# Altium project Worldskills Pre-Comp Task.PrjPcb
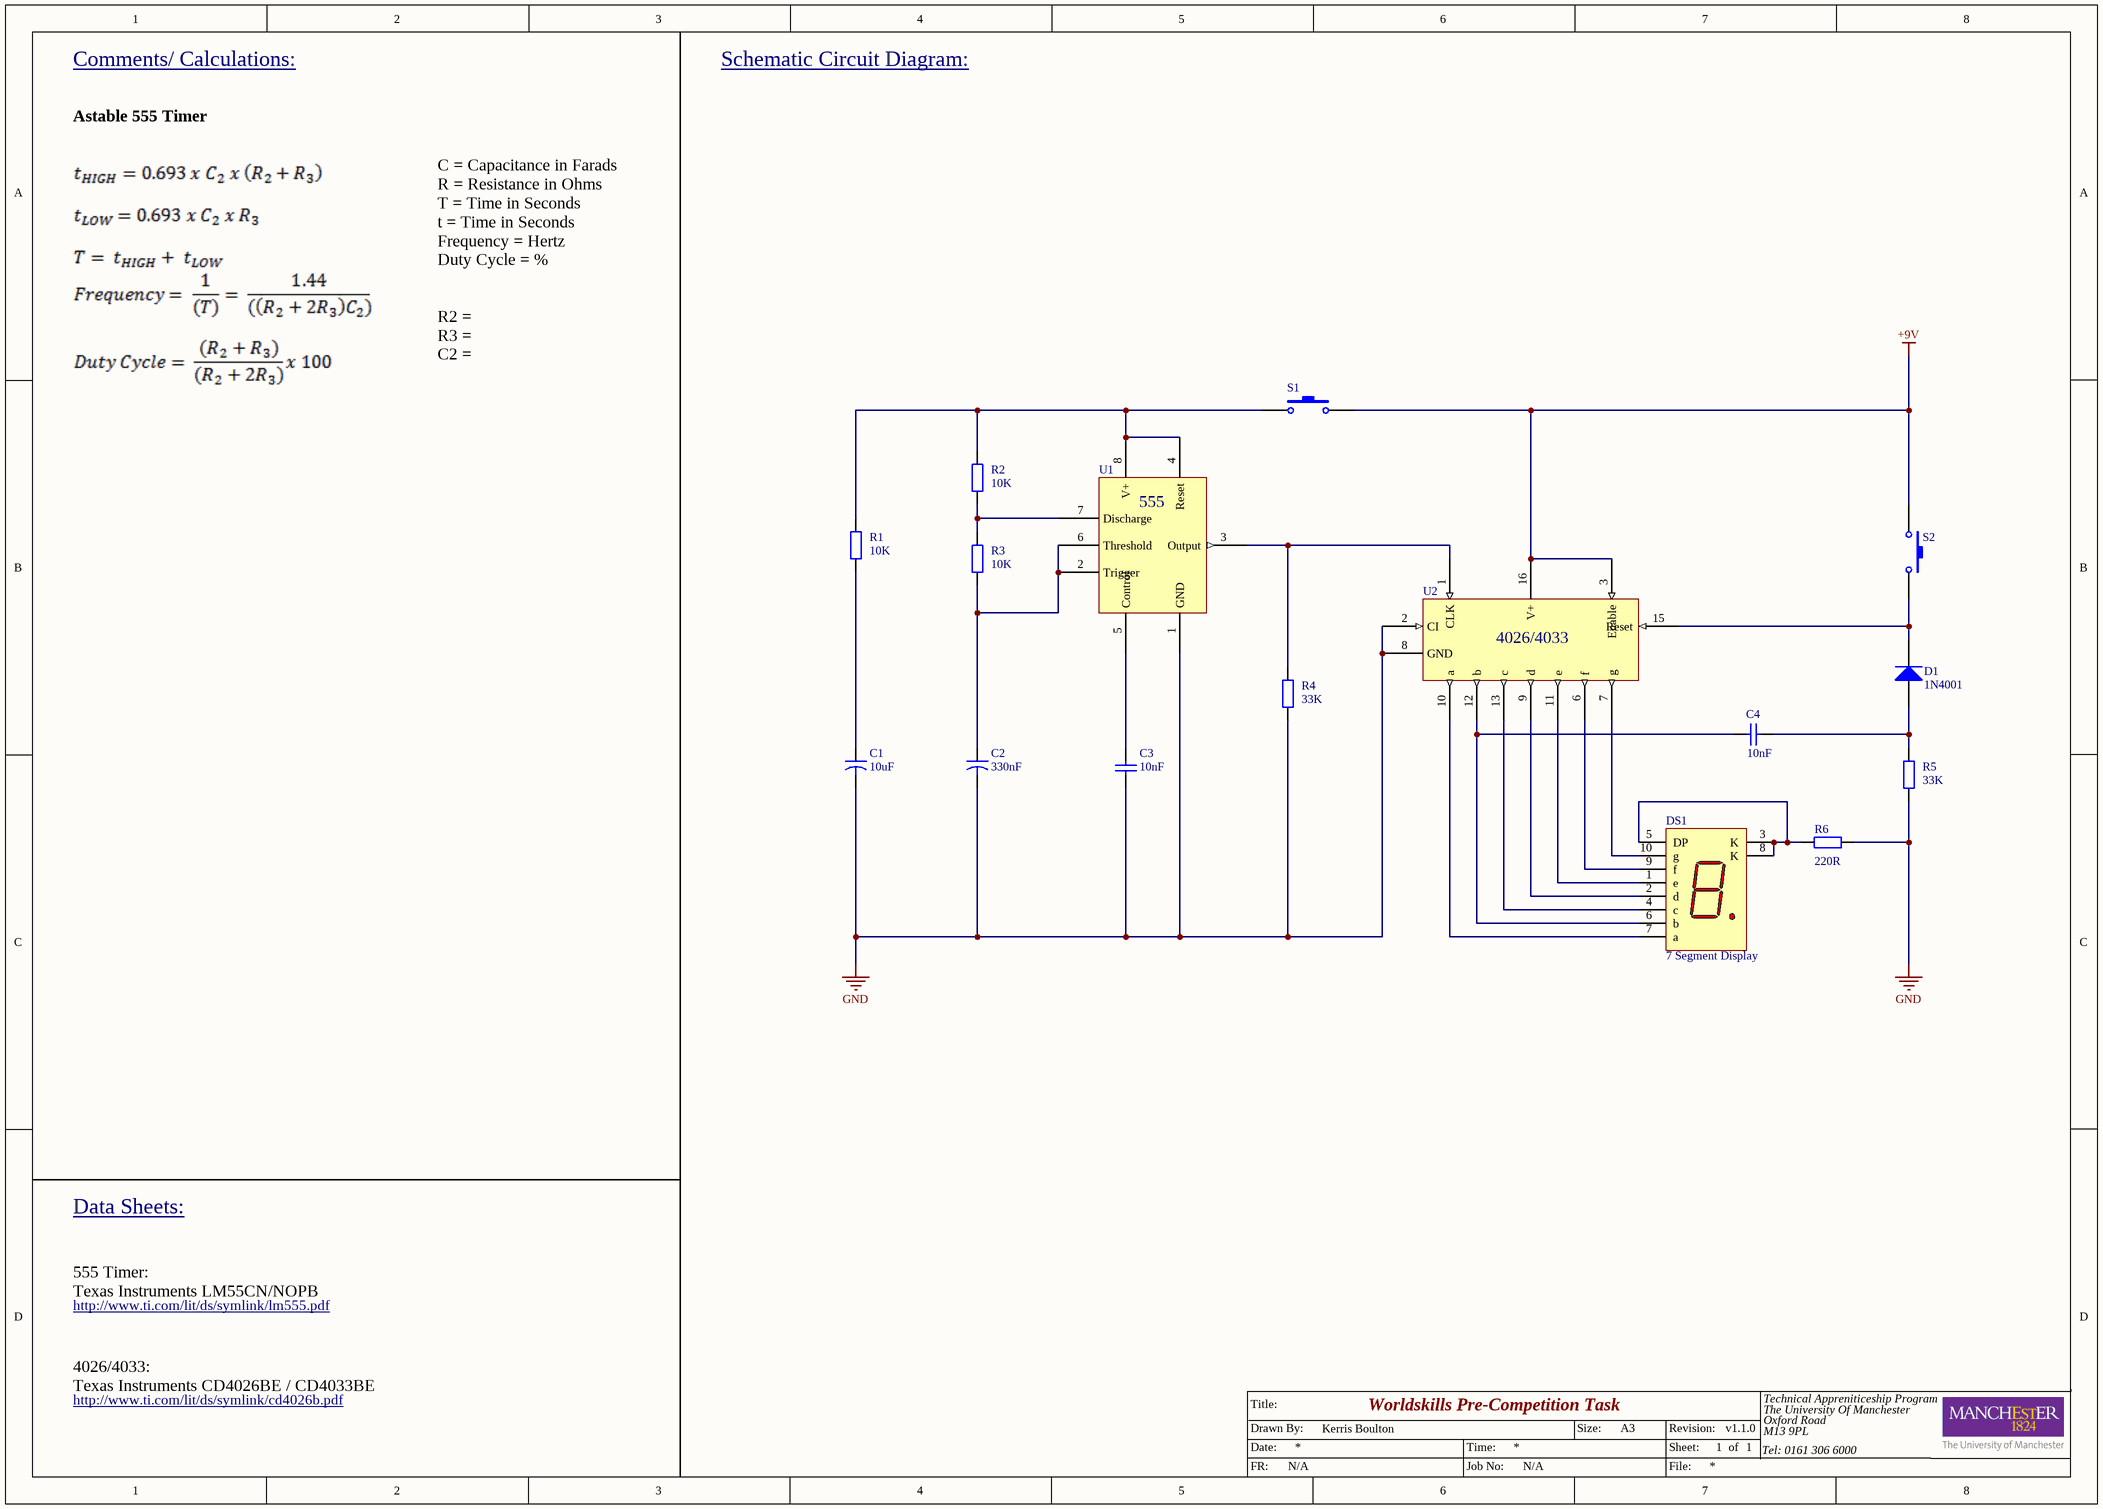
[diagram p0: Figure1.SchDoc]
1 sheet, 16 parts. Net scope: global (net labels, ports and power ports of the same name join across sheets).

## Sheet Figure1.SchDoc: Worldskills Pre-Competition Task
size A3; DrawnBy: Kerris Boulton; Organization: Technical Appreniticeship Program; Address1: The University Of Manchester; Address2: Oxford Road; Address3: M13 9PL; Address4: Tel: 0161 306 6000; DocumentNumber: 1; Revision: v1.1.0; SheetNumber: 1; SheetTotal: 1; FR: N/A; JobNo: N/A

### Parts
C1  10uF  [CAPR5-4X5]
C2  330nF  [CAPR5-4X5]
C3  10nF  [RAD-0.3]
C4  10nF  [RAD-0.3]
D1  1N4001  [DO-41]
DS1  7 Segment Display  [A]
R1  10K  [AXIAL-0.4]
R2  10K  [AXIAL-0.4]
R3  10K  [AXIAL-0.4]
R4  33K  [AXIAL-0.4]
R5  33K  [AXIAL-0.4]
R6  220R  [AXIAL-0.4]
S1  SW-PB  [SPST-2]  (value not drawn)
S2  SW-PB  [SPST-2]  (value not drawn)
U1  555  [555]  (value not drawn)
U2  4026/4033  [4026/4033]  (value not drawn)

### Nets
+9V: S1.2 S2.1 U2.3(Enable) U2.16(V+)
GND: C1.2 C2.2 C3.1 R4.1 R5.1 R6.2 U1.1(GND) U2.2(CI) U2.8(GND)
NetC1_1: C1.1 R1.1
NetC2_1: C2.1 R3.1 U1.2(Trigger) U1.6(Threshold)
NetC3_2: C3.2 U1.5(Control)
NetC4_1: C4.1 DS1.6(b) U2.12(b)
NetC4_2: C4.2 D1.1(A) R5.2
NetD1_2: D1.2(K) S2.2 U2.15(Reset)
NetDS1_1: DS1.1(e) U2.11(e)
NetDS1_2: DS1.2(d) U2.9(d)
NetDS1_3: DS1.3(K) DS1.5(DP) DS1.8(K) R6.1
NetDS1_4: DS1.4(c) U2.13(c)
NetDS1_7: DS1.7(a) U2.10(a)
NetDS1_9: DS1.9(f) U2.6(f)
NetDS1_10: DS1.10(g) U2.7(g)
NetR1_2: R1.2 R2.2 S1.1 U1.4(Reset) U1.8(V+)
NetR2_1: R2.1 R3.2 U1.7(Discharge)
NetR4_2: R4.2 U1.3(Output) U2.1(CLK)

### Notes on the sheet
- Comments/ Calculations:
- Schematic Circuit Diagram:
- Astable 555 Timer
- C = Capacitance in Farads
  R = Resistance in Ohms
  T = Time in Seconds
  t = Time in Seconds
  Frequency = Hertz
  Duty Cycle = %
  R2 =
  R3 =
  C2 =
- Data Sheets:
- http://www.ti.com/lit/ds/symlink/lm555.pdf
- 555 Timer:
  Texas Instruments LM55CN/NOPB
  4026/4033:
  Texas Instruments CD4026BE / CD4033BE
- http://www.ti.com/lit/ds/symlink/cd4026b.pdf <http://>
- Title:
- Date:
- Drawn By:
- Time:
- Size:
- A3
- Revision:
- Sheet:
- of
- FR:
- Job No:
- File:

### Library data of the parts
C1 C2 = Cap2: Capacitor; Published: 23-Sep-2002; PackageReference: CAPR5-4X5; Publisher: Altium Limited; PackageDescription: Capacitor; 2 Leads
  C1: Value: 10uF
  C2: Value: 330nF
C3 C4 = Cap: Capacitor; Published: 8-Jun-2000; LatestRevisionDate: 17-Jul-2002; LatestRevisionNote: Re-released for DXP Platform.; PackageReference: RAD-0.3; Publisher: Altium Limited; PackageDescription: Radial Cap, Thru-Hole; 2 Leads; 0.3 in Pin Spacing; Value: 10nF
D1 = Diode 1N4001: 1 Amp General Purpose Rectifier; Published: 8-Jun-2000; LatestRevisionDate: 17-Jul-2002; LatestRevisionNote: Re-released for DXP Platform.; DatasheetVersion: 1998; PackageVersion: Aug-1999; PackageReference: DO-41; Publisher: Altium Limited; PackageDescription: Diode, Axial; Body 5.2 x 2.7 mm (LxDia. max), Lead Dia. 0.86 mm (max); Code_JEDEC: DO-204-AL; ComponentLink1Description: Manufacturer Link; ComponentLink1URL: http://www.fairchildsemi.com/; ComponentLink2Description: Datasheet; ComponentLink2URL: http://www.fairchildsemi.com/ds/1N%2F1N4001.pdf
DS1 = Dpy Red-CC: MinimumIntensity: 360 ucd; Colour: High Efficiency Red (HER); Published: 8-Jun-2000; LatestRevisionDate: 17-Dec-2003; LatestRevisionNote: Schematic revised, PCB Footprint replaced.; DatasheetVersion: 19-Feb-2002; PackageVersion: 11-Feb-2002; PackageReference: A; Publisher: Altium Limited; PackageDescription: LED, 7-Segment Display, 7.62 mm, RHD; 10 Leads; Row Space 5.08 mm; Pitch 2.54 mm; ComponentLink1Description: Manufacturer Link; ComponentLink1URL: http://www.agilent.com/
R1-R6 = Res2: Resistor; Published: 8-Jun-2000; LatestRevisionDate: 17-Jul-2002; LatestRevisionNote: Re-released for DXP Platform.; PackageReference: AXIAL-0.4; Publisher: Altium Limited; PackageDescription: Axial Device, Thru-Hole; 2 Leads; 0.4 in Pin Spacing
  R1-R3: Value: 10K
  R4 R5: Value: 33K
  R6: Value: 220R
S1 S2 = SW-PB: SPST Switch; Published: 24-Mar-1999; LatestRevisionDate: 17-Jul-2002; LatestRevisionNote: Re-released for DXP Platform.; PackageReference: SPST-2; Publisher: Altium Limited; PackageDescription: Switch; 2 Leads
U1 = 555 TIMER
U2 = 4026/4033: Decade Counter/Divider